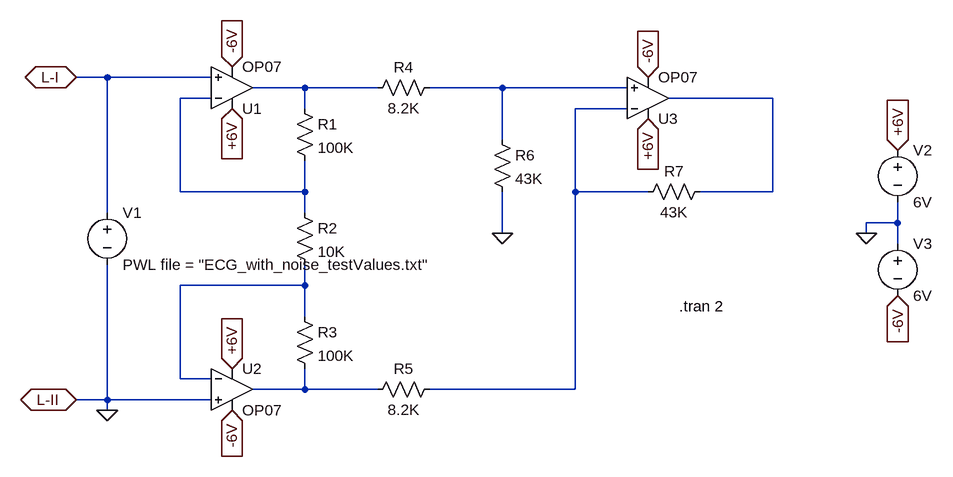
[diagram p0: schematic Instrumentation_Amplifier.asc]
Instrumentation_Amplifier.asc, the LTspice schematic file:
Version 4
SHEET 1 1092 792
WIRE -192 192 -240 192
WIRE -32 192 -192 192
WIRE 112 208 32 208
WIRE 224 208 112 208
WIRE 416 208 304 208
WIRE 608 208 416 208
WIRE -32 224 -80 224
WIRE 832 224 672 224
WIRE 112 240 112 208
WIRE 608 240 528 240
WIRE 416 288 416 208
WIRE -80 368 -80 224
WIRE 112 368 112 320
WIRE 112 368 -80 368
WIRE 528 368 528 240
WIRE 640 368 528 368
WIRE 832 368 832 224
WIRE 832 368 720 368
WIRE -192 400 -192 192
WIRE 112 400 112 368
WIRE 1024 416 1024 384
WIRE 1024 416 976 416
WIRE 416 432 416 368
WIRE 976 432 976 416
WIRE 1024 448 1024 416
WIRE 112 512 112 480
WIRE 112 512 -80 512
WIRE 112 560 112 512
WIRE -80 656 -80 512
WIRE -32 656 -80 656
WIRE 112 672 112 640
WIRE 112 672 32 672
WIRE 224 672 112 672
WIRE 528 672 528 368
WIRE 528 672 304 672
WIRE -192 688 -192 480
WIRE -192 688 -240 688
WIRE -32 688 -192 688
WIRE -192 704 -192 688
FLAG -192 704 0
FLAG 0 240 +6V
IOPIN 0 240 In
FLAG 0 640 +6V
IOPIN 0 640 In
FLAG 0 176 -6V
IOPIN 0 176 In
FLAG 0 704 -6V
IOPIN 0 704 In
FLAG 416 432 0
FLAG 640 256 +6V
IOPIN 640 256 In
FLAG 640 192 -6V
IOPIN 640 192 In
FLAG -240 192 L-I
IOPIN -240 192 BiDir
FLAG -240 688 L-II
IOPIN -240 688 BiDir
FLAG 976 432 0
FLAG 1024 304 +6V
IOPIN 1024 304 In
FLAG 1024 528 -6V
IOPIN 1024 528 In
SYMBOL OpAmps/OP07 0 272 M180
SYMATTR InstName U1
SYMBOL Res 96 224 R0
SYMATTR InstName R1
SYMATTR Value 100K
SYMBOL Res 96 384 R0
SYMATTR InstName R2
SYMATTR Value 10K
SYMBOL Res 96 544 R0
SYMATTR InstName R3
SYMATTR Value 100K
SYMBOL OpAmps/OP07 0 608 R0
SYMATTR InstName U2
SYMBOL Voltage -192 384 R0
SYMATTR InstName V1
SYMATTR Value PWL file = "ECG_with_noise_testValues.txt"
SYMBOL Res 320 192 R90
WINDOW 0 0 56 VBottom 2
WINDOW 3 32 56 VTop 2
SYMATTR InstName R4
SYMATTR Value 8.2K
SYMBOL Res 320 656 R90
WINDOW 0 0 56 VBottom 2
WINDOW 3 32 56 VTop 2
SYMATTR InstName R5
SYMATTR Value 8.2K
SYMBOL Res 400 272 R0
SYMATTR InstName R6
SYMATTR Value 43K
SYMBOL OpAmps/OP07 640 288 M180
SYMATTR InstName U3
SYMBOL Res 736 352 R90
WINDOW 0 0 56 VBottom 2
WINDOW 3 32 56 VTop 2
SYMATTR InstName R7
SYMATTR Value 43K
SYMBOL Voltage 1024 288 R0
SYMATTR InstName V2
SYMATTR Value 6V
SYMBOL Voltage 1024 432 R0
SYMATTR InstName V3
SYMATTR Value 6V
TEXT 688 544 Left 2 !.tran 2

The netlist it stands for:
* Instrumentation_Amplifier.asc
XU1 L-I N003 +6V -6V N001 LT1001  ; OP07, pins In+ In- V+ V- OUT
R1 N001 N003 100K
R2 N003 N006 10K
R3 N006 N007 100K
XU2 0 N006 +6V -6V N007 LT1001  ; OP07, pins In+ In- V+ V- OUT
V1 L-I 0 PWL file = "ECG_with_noise_testValues.txt"
R4 N002 N001 8.2K
R5 N005 N007 8.2K
R6 N002 0 43K
XU3 N002 N005 +6V -6V N004 LT1001  ; OP07, pins In+ In- V+ V- OUT
R7 N004 N005 43K
V2 +6V 0 6V
V3 0 -6V 6V
.tran 2
.lib LTC.lib
.backanno
.end